# Altium schematic sheet PWM 缓冲.SchDoc
size A3
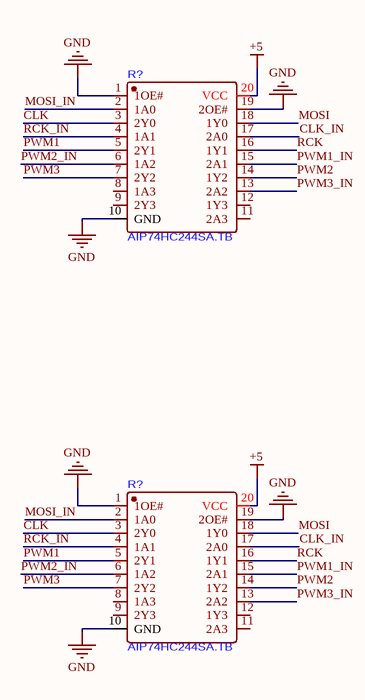
[diagram p0: PWM 缓冲.SchDoc]

## Parts
(Parts that share a designator on the sheet are numbered #1, #2 ... from top to bottom, then left to right.)
R?#1  AIP74HC244SA.TB  [SOP-20_L12.7-W7.5-P1.27-LS10.2-BL]
R?#2  AIP74HC244SA.TB  [SOP-20_L12.7-W7.5-P1.27-LS10.2-BL]

## Nets
+5: R?#1.20(VCC) R?#2.20(VCC)
GND: R?#1.1(1OE#) R?#1.10(GND) R?#1.19(2OE#) R?#2.1(1OE#) R?#2.10(GND) R?#2.19(2OE#)
CLK: R?#1.3(2Y0) R?#2.3(2Y0)
CLK_IN: R?#1.17(2A0) R?#2.17(2A0)
MOSI: R?#1.18(1Y0) R?#2.18(1Y0)
MOSI_IN: R?#1.2(1A0) R?#2.2(1A0)
PWM1: R?#1.5(2Y1) R?#2.5(2Y1)
PWM1_IN: R?#1.15(2A1) R?#2.15(2A1)
PWM2: R?#1.14(1Y2) R?#2.14(1Y2)
PWM2_IN: R?#1.6(1A2) R?#2.6(1A2)
PWM3: R?#1.7(2Y2) R?#2.7(2Y2)
PWM3_IN: R?#1.13(2A2) R?#2.13(2A2)
RCK: R?#1.16(1Y1) R?#2.16(1Y1)
RCK_IN: R?#1.4(1A1) R?#2.4(1A1)

Not connected (* = marked no-connect by the designer): R?#1 8(1A3) 9(2Y3) 11(2A3) 12(1Y3); R?#2 8(1A3) 9(2Y3) 11(2A3) 12(1Y3)